# Altium schematic sheet Sheet1.SchDoc
size A4
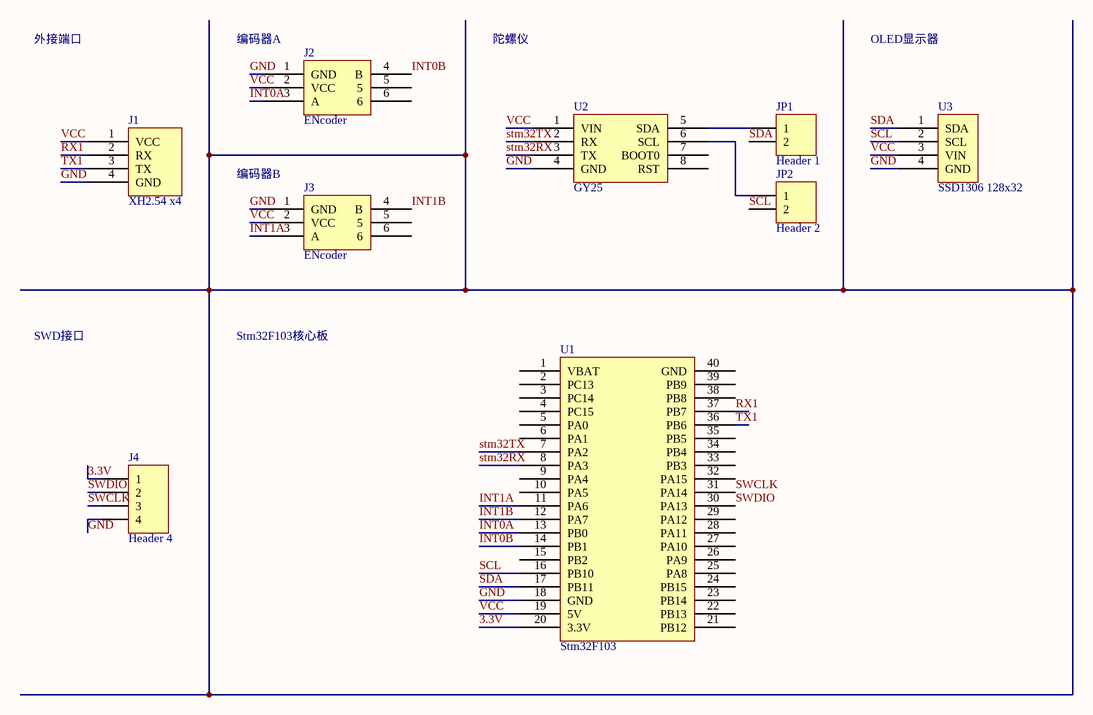
[diagram p0: Sheet1.SchDoc]

## Parts
J1  XH2.54 x4  [XH2.54]
J2  ENcoder  [6pin2]
J3  ENcoder  [6pin2]
J4  Header 4  [HDR1X4]
JP1  Header 1  [HDR1X2]
JP2  Header 2  [HDR1X2]
U1  Stm32F103  [STM32F103C8T6-4]
U2  GY25  [PCBComponent_1]
U3  SSD1306 128x32  [SSD1306 iic]

## Nets
3.3V: J4.1 U1.20(3.3V)
GND: J1.4(GND) J2.1(GND) J3.1(GND) J4.4 U1.18(GND) U2.4(GND) U3.4(GND)
INT0A: J2.3(A) U1.13(PB0)
INT0B: J2.4(B) U1.14(PB1)
INT1A: J3.3(A) U1.11(PA6)
INT1B: J3.4(B) U1.12(PA7)
RX1: J1.2(RX) U1.37(PB7)
SCL: JP2.2 U1.16(PB10) U3.2(SCL)
SDA: JP1.2 U1.17(PB11) U3.1(SDA)
stm32RX: U1.8(PA3) U2.3(TX)
stm32TX: U1.7(PA2) U2.2(RX)
SWCLK: J4.3 U1.31(PA14)
SWDIO: J4.2 U1.30(PA13)
TX1: J1.3(TX) U1.36(PB6)
VCC: J1.1(VCC) J2.2(VCC) J3.2(VCC) U1.19(5V) U2.1(VIN) U3.3(VIN)
NetJP1_1: JP1.1 U2.5(SDA)
NetJP2_1: JP2.1 U2.6(SCL)

Not connected (* = marked no-connect by the designer): J2 5 6; J3 5 6; U1 1(VBAT) 2(PC13) 3(PC14) 4(PC15) 5(PA0) 6(PA1) 9(PA4) 10(PA5) 15(PB2) 21(PB12) 22(PB13) 23(PB14) 24(PB15) 25(PA8) 26(PA9) 27(PA10) 28(PA11) 29(PA12) 32(PA15) 33(PB3) 34(PB4) 35(PB5) 38(PB8) 39(PB9) 40(GND); U2 7(BOOT0) 8(RST)

## Notes on the sheet
- 外接端口
- (near J2) 编码器A
- 陀螺仪
- OLED显示器
- 编码器B
- SWD接口
- Stm32F103核心板

## Library data of the parts
J4 = Header 4: Header, 4-Pin; LatestRevisionDate: 17-Jul-2002; LatestRevisionNote: Re-released for DXP Platform.; Publisher: Altium Limited
JP1 JP2 = Header 2: Header, 2-Pin; LatestRevisionDate: 17-Jul-2002; LatestRevisionNote: Re-released for DXP Platform.; Publisher: Altium Limited
U1 = Component_1